# Altium schematic sheet GPIOSheet.SchDoc
size A4; SheetNumber: 4; SheetTotal: 6
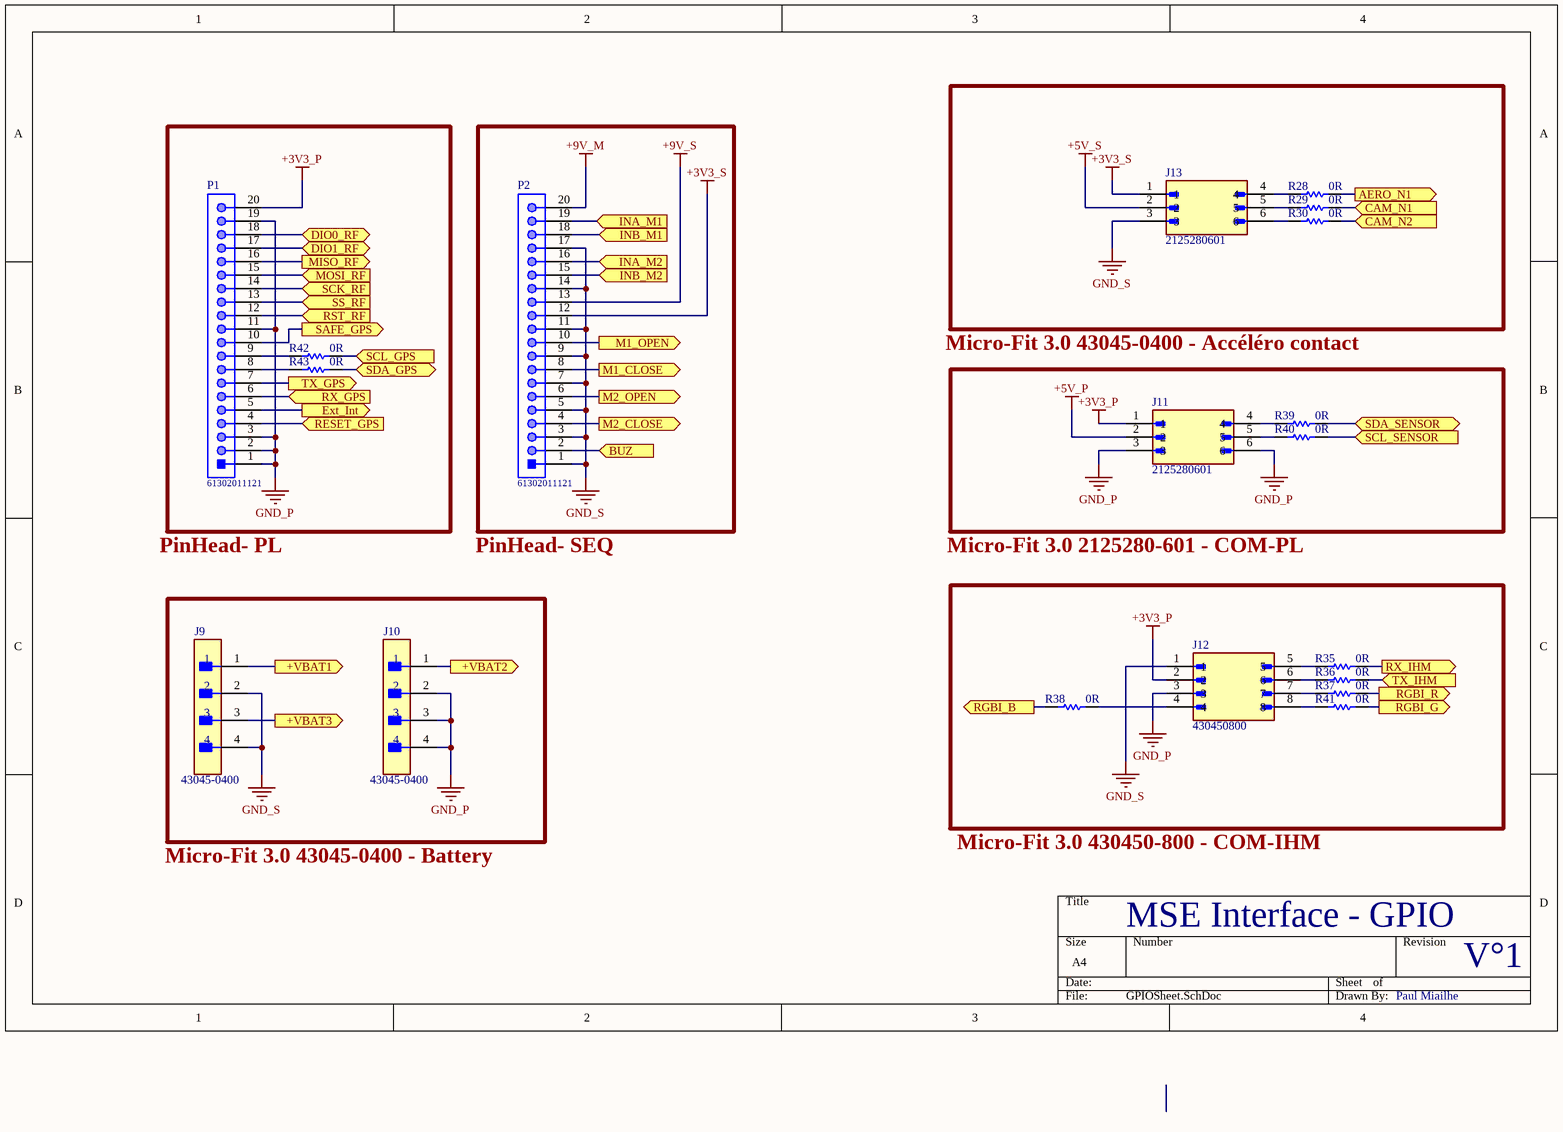
[diagram p0: GPIOSheet.SchDoc]

## Parts
J9  43045-0400  [FP-43045-0400-MFG]
J10  43045-0400  [FP-43045-0400-MFG]
J11  2125280601  [MOLEX_2125280601]
J12  430450800  [MOLEX_430450800]
J13  2125280601  [MOLEX_2125280601]
P1  61302011121  [61302011121]
P2  61302011121  [61302011121]
R28  0R  [RESC1608X55X25ML10T15]
R29  0R  [RESC1608X55X25ML10T15]
R30  0R  [RESC1608X55X25ML10T15]
R35  0R  [RESC1608X55X25ML10T15]
R36  0R  [RESC1608X55X25ML10T15]
R37  0R  [RESC1608X55X25ML10T15]
R38  0R  [RESC1608X55X25ML10T15]
R39  0R  [RESC1608X55X25ML10T15]
R40  0R  [RESC1608X55X25ML10T15]
R41  0R  [RESC1608X55X25ML10T15]
R42  0R  [RESC1608X55X25ML10T15]
R43  0R  [RESC1608X55X25ML10T15]

## Ports
+VBAT1 (out, see MainSheet[2B], PowerSheet[1A]), +VBAT2 (out, see MainSheet[2B], PowerSheet[1C]), +VBAT3 (out, see MainSheet[2B], PowerSheet[3A]), AERO_N1 (out, see MainSheet[2B], MicroSEQSheet[3B]), BUZ (in, see MainSheet[2C], MicroSEQSheet[1B]), CAM_N1 (in, see MainSheet[2B], MicroSEQSheet[1B]), CAM_N2 (in, see MainSheet[2B], MicroSEQSheet[1B]), DIO0_RF (bidir, see MainSheet[3B]), DIO1_RF (bidir, see MainSheet[3C]), Ext_Int (out, see MainSheet[3C], MicroPLSheet[3B]), INA_M1 (in, see MainSheet[2C], MicroSEQSheet[2C]), INA_M2 (in, see MainSheet[2C], MicroSEQSheet[2C]), INB_M1 (in, see MainSheet[2C], MicroSEQSheet[2C]), INB_M2 (in, see MainSheet[2C], MicroSEQSheet[2B]), M1_CLOSE (out, see MainSheet[2C]), M1_OPEN (out, see MainSheet[2C]), M2_CLOSE (out, see MainSheet[2C]), M2_OPEN (out, see MainSheet[2C]), MISO_RF (out, see MainSheet[3B], MicroPLSheet[2C]), MOSI_RF (in, see MainSheet[3B], MicroPLSheet[2C]), RESET_GPS (in, see MainSheet[3C], MicroPLSheet[3C]), RGBI_B (out, see MainSheet[3C], MicroPLSheet[3C], MicroPLSheet[4B]), RGBI_G (out, see MainSheet[3C], MicroPLSheet[3C], MicroPLSheet[4B]), RGBI_R (out, see MainSheet[3C], MicroPLSheet[3C], MicroPLSheet[4B]), RST_RF (in, see MainSheet[3B], MicroPLSheet[2C]), RX_GPS (in, see MainSheet[3C]), RX_IHM (out, see MainSheet[2B], MicroSEQSheet[1B]), SAFE_GPS (out, see MainSheet[3C], MicroPLSheet[3B]), SCK_RF (in, see MainSheet[3B], MicroPLSheet[2B]), SCL_GPS (in, see MainSheet[3C]), SCL_SENSOR (in, see MainSheet[3C]), SDA_GPS (bidir, see MainSheet[3C]), SDA_SENSOR (bidir, see MainSheet[3C]), SS_RF (in, see MainSheet[3B], MicroPLSheet[2C]), TX_GPS (out, see MainSheet[3C]), TX_IHM (in, see MainSheet[2B], MicroSEQSheet[1B])

## Nets
+3V3_P: J11.1 J12.2 P1.20
+3V3_S: J13.1 P2.12
+5V_P: J11.2
+5V_S: J13.2
+9V_M: P2.20
+9V_S: P2.13
GND_P: J10.2 J10.3 J10.4 J11.3 J11.6 J12.3 P1.1 P1.2 P1.3 P1.11 P1.19
GND_S: J9.2 J9.4 J12.1 J13.3 P2.1 P2.3 P2.5 P2.7 P2.9 P2.11 P2.14 P2.17
+VBAT1: J9.1 ; port +VBAT1
+VBAT2: J10.1 ; port +VBAT2
+VBAT3: J9.3 ; port +VBAT3
AERO_N1: R28.2 ; port AERO_N1
BUZ: P2.2 ; port BUZ
CAM_N1: R29.2 ; port CAM_N1
CAM_N2: R30.2 ; port CAM_N2
DIO0_RF: P1.18 ; port DIO0_RF
DIO1_RF: P1.17 ; port DIO1_RF
Ext_Int: P1.5 ; port Ext_Int
INA_M1: P2.19 ; port INA_M1
INA_M2: P2.16 ; port INA_M2
INB_M1: P2.18 ; port INB_M1
INB_M2: P2.15 ; port INB_M2
M1_CLOSE: P2.8 ; port M1_CLOSE
M1_OPEN: P2.10 ; port M1_OPEN
M2_CLOSE: P2.4 ; port M2_CLOSE
M2_OPEN: P2.6 ; port M2_OPEN
MISO_RF: P1.16 ; port MISO_RF
MOSI_RF: P1.15 ; port MOSI_RF
RESET_GPS: P1.4 ; port RESET_GPS
RGBI_B: R38.1 ; port RGBI_B
RGBI_G: R41.1 ; port RGBI_G
RGBI_R: R37.1 ; port RGBI_R
RST_RF: P1.12 ; port RST_RF
RX_GPS: P1.6 ; port RX_GPS
RX_IHM: R35.2 ; port RX_IHM
SAFE_GPS: P1.10 ; port SAFE_GPS
SCK_RF: P1.14 ; port SCK_RF
SCL_GPS: R42.2 ; port SCL_GPS
SCL_SENSOR: R40.2 ; port SCL_SENSOR
SDA_GPS: R43.2 ; port SDA_GPS
SDA_SENSOR: R39.2 ; port SDA_SENSOR
SS_RF: P1.13 ; port SS_RF
TX_GPS: P1.7 ; port TX_GPS
TX_IHM: R36.2 ; port TX_IHM
NetJ11_4: J11.4 R39.1
NetJ11_5: J11.5 R40.1
NetJ12_4: J12.4 R38.2
NetJ12_5: J12.5 R35.1
NetJ12_6: J12.6 R36.1
NetJ12_7: J12.7 R37.2
NetJ12_8: J12.8 R41.2
NetJ13_4: J13.4 R28.1
NetJ13_5: J13.5 R29.1
NetJ13_6: J13.6 R30.1
NetP1_8: P1.8 R43.1
NetP1_9: P1.9 R42.1

## Notes on the sheet
- Micro-Fit 3.0 43045-0400 - Accéléro contact
- PinHead- PL
- PinHead- SEQ
- Micro-Fit 3.0 2125280-601 - COM-PL
- Micro-Fit 3.0 43045-0400 - Battery
- Micro-Fit 3.0 430450-800 - COM-IHM
- MSE Interface - GPIO
- V°1
- Paul Miailhe

## Library data of the parts
J9 J10 = CMP-04776-000002-1: CONN HEADER R/A 4POS 3MM; Manufacturer: Molex; Conn Gender: Male; Conn Orientation: Right Angle; Voltage Rating: 600V; Number Of Contacts: 4; Is Female: yes; Current Rating: 8.5A; ComponentLink2URL: https://www.molex.com/webdocs/datasheets/pdf/en-us/0430450400_PCB_HEADERS.pdf; Manufacturer Part Number: 43045-0400; Digikey Description: CONN HEADER R/A 4POS 3MM; Category: Conn; Temperature Range High: +105°C; Lead Free: Yes; Device Class L1: Connectors; Automotive: No; Temperature: -40°C to +105°C; Footprint Url: https://www.molex.com/pdm_docs/sd/430450400_sd.pdf; Height: 9.27mm; Number Of Rows: 2; Device Class L3: unset; Pitch: 3mm; Temperature Range Low: -40°C; Contact Material: Tin,Nickel; Octopart: https://octopart.com/43045-0400-molex-287063; RoHS: TRUE; ComponentLink2Description: Datasheet; Package: 43045-0400; Device Class L2: Headers and Wire Housings
J11 J13 = CMP-013-000000-2: Connector Header Through Hole, Right Angle 6 position 0.118 (3.00mm); MF: Molex; MP: 2125280601; Package: None; Design Item ID: 2125280601; Source: 2125280601.SchLib; Price: None; SnapEDA_Link: https://www.snapeda.com/parts/2125280601/Molex/view-part/?ref=snap; Availability: In Stock; Component Type: Standard; Value: *; Pin Count: 6; Purchase-URL: https://pricing.snapeda.com/search/part/2125280601/?ref=eda; Check_prices: https://www.snapeda.com/parts/2125280601/Molex/view-part/?ref=eda
J12 = CMP-015-000000-4: Connector Header Through Hole, Right Angle 8 position 0.118 (3.00mm); MF: Molex; MP: 43045-0800; Pin Count: 8; Purchase-URL: https://pricing.snapeda.com/search/part/43045-0800/?ref=eda; SnapEDA_Link: https://www.snapeda.com/parts/43045-0800/Molex/view-part/?ref=snap; Component Type: Standard; Price: None; Design Item ID: 430450800; Source: 430450800.SchLib; Check_prices: https://www.snapeda.com/parts/43045-0800/Molex/view-part/?ref=eda; Availability: In Stock; Value: *; Package: None
P1 P2 = CMP-1502-01102-1: THT Vertical Pin Header WR-PHD, Pitch 2.54 mm, Single Row, 20 pins; Manufacturer: Wurth Elektronik; Withstanding Voltage: 500VAC; Gender: Male; Pin Number: 20; Rated Current: 3A; Contact Resistance: 20mOhm; Pitch: 2.54mm; Working Voltage: 250VAC; Publisher: WurthElektronik; Packaging: Bag; Datasheet URL: https://katalog.we-online.de/em/datasheet/6130xx11121.pdf; Row Number: Single; Mounting Technology: THT; Manufacturer URL: http://www.we-online.de; Orientation: Vertical; Package Reference: 61302011121; Part Number: 61302011121; Operating Temperature: -40to105degC
R28-R30 R35-R43 = CMP-2100-03667-1: Chip Resistor, 0 Ohm, +/- 5%, 0.1 W, -55 to 155 degC, 0603 (1608 Metric), RoHS, Tape and Reel; Manufacturer: Yageo; Temperature Coefficient: 200ppm/degreesC; Voltage Rating: 50V; Power Rating: 100mW; Resistance: 0mOhm; Width: 0.8mm; Max Operating Temperature: 155degC; Tolerance: 5%; Package Reference: 0603; Height: 0.45mm; Depth: 0.8mm; Package Description: 2-Pin Surface Mount Device, Body 1.6 x 0.8 mm; Termination: SMD/SMT; Package Quantity: 5000; Case/Package: 0603; Case Code (Imperial): 0603; Radiation Hardening: No; Number of Pins: 2; Length: 1.6mm; Lead Free: LeadFree; Voltage Rating (DC): 50V; Military Standard: Not; Datasheet URL: http://www.yageo.com/NewPortal/yageodocoutput?fileName=/pdf/R-Chip/PYu-RC_Group_51_RoHS_L_5.pdf; Manufacturer URL: http://www.yageo.com/; Packaging: TapeandReel; Case Code (Metric): 1608; Min Operating Temperature: -55degC; Composition: ThickFilm; RoHSCompliant: true; Contact Plating: Tin; Datasheet Version: Rev. 5, 10/2016; REACH SVHC: NoSVHC